# Altium schematic sheet Input channel.SchDoc
size A4; Organization: Altium Limited; Address1: L3, 12a Rodborough Rd; Address2: Frenchs Forest; Address3: NSW; Address4: Australia 2086; DocumentNumber: 4; SheetNumber: 4; SheetTotal: 8
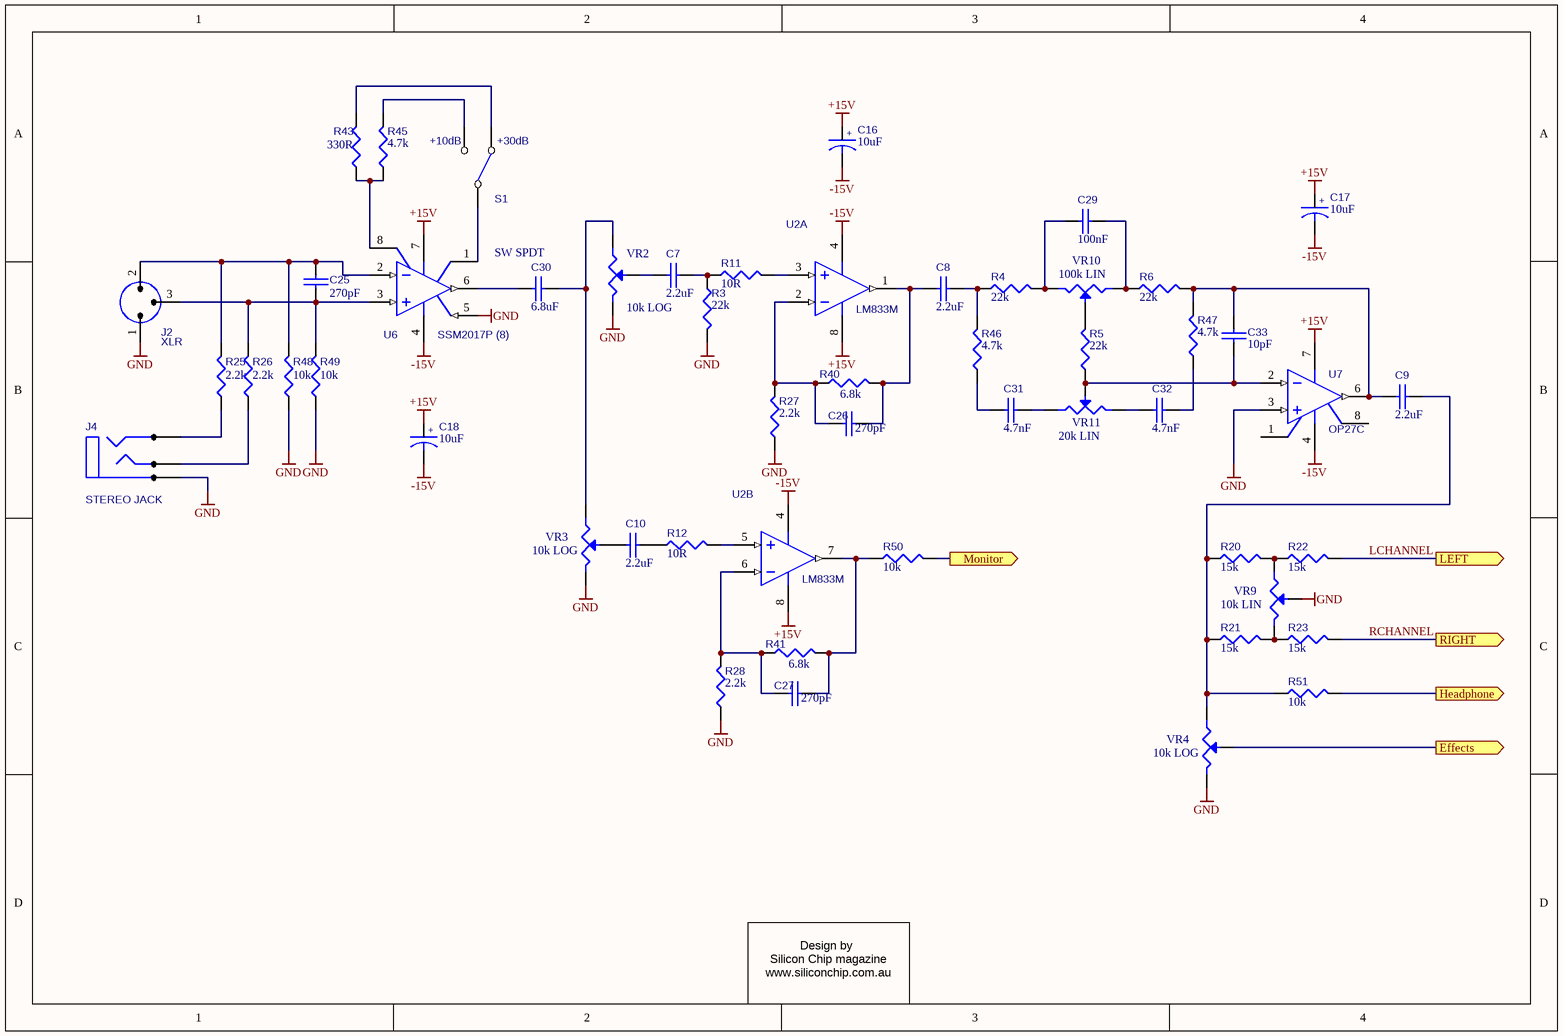
[diagram p0: Input channel.SchDoc]

## Parts
C7  2.2uF  [RB.2/.4-NP]
C8  2.2uF  [RB.2/.4-NP]
C9  2.2uF  [RB.2/.4-NP]
C10  2.2uF  [RB.2/.4-NP]
C16  10uF  [RB.2/.4]
C17  10uF  [RB.2/.4]
C18  10uF  [RB.2/.4]
C25  270pF  [RAD0.2]
C26  270pF  [RAD0.2]
C27  270pF  [RAD0.2]
C29  100nF  [RAD0.2]
C30  6.8uF  [RB.2/.4-NP]
C31  4.7nF  [RAD0.2]
C32  4.7nF  [RAD0.2]
C33  10pF  [RAD0.2]
J2  XLR  [XLR-FEMALE]
J4  STEREO JACK  [JACK-6.25MM]
R3  22k  [AXIAL0.4]
R4  22k  [AXIAL0.4]
R5  22k  [AXIAL0.4]
R6  22k  [AXIAL0.4]
R11  10R  [AXIAL0.4]
R12  10R  [AXIAL0.4]
R20  15k  [AXIAL0.4]
R21  15k  [AXIAL0.4]
R22  15k  [AXIAL0.4]
R23  15k  [AXIAL0.4]
R25  2.2k  [AXIAL0.4]
R26  2.2k  [AXIAL0.4]
R27  2.2k  [AXIAL0.4]
R28  2.2k  [AXIAL0.4]
R40  6.8k  [AXIAL0.4]
R41  6.8k  [AXIAL0.4]
R43  330R  [AXIAL0.4]
R45  4.7k  [AXIAL0.4]
R46  4.7k  [AXIAL0.4]
R47  4.7k  [AXIAL0.4]
R48  10k  [AXIAL0.4]
R49  10k  [AXIAL0.4]
R50  10k  [AXIAL0.4]
R51  10k  [AXIAL0.4]
S1  SW SPDT  [SW-SPDT]
U2  LM833M  [DIP8]  (parts A,B of 2)
U6  SSM2017P (8)  [DIP8]
U7  OP27C  [DIP8]
VR2  10k LOG  [POT - 24MM]
VR3  10k LOG  [POT - 24MM]
VR4  10k LOG  [POT - 24MM]
VR9  10k LIN  [POT - 24MM]
VR10  100k LIN  [POT - 24MM]
VR11  20k LIN  [POT - 24MM]

## Ports
Effects (out), Headphone (out), LEFT (out), Monitor (out), RIGHT (out)

## Nets
+15V: C16.1 C17.1 C18.1 U2.8(V+) U6.7(V+) U7.7(V+)
-15V: C16.2 C17.2 C18.2 U2.4(V-) U6.4(V-) U7.4(V-)
GND: J2.1 J4.3(C) R3.2 R27.1 R28.1 R48.1 R49.1 U6.5(REF) U7.3(+IN) VR2.3 VR3.3 VR4.3 VR9.2(W)
Effects: VR4.2(W) ; port Effects
Headphone: R51.2 ; port Headphone
LCHANNEL: R22.2 ; port LEFT
Monitor: R50.2 ; port Monitor
RCHANNEL: R23.2 ; port RIGHT
NetC7_1: C7.1 VR2.2(W)
NetC7_2: C7.2 R3.1 R11.1
NetC8_1: C8.1 C26.2 R40.2 U2.1(OUT1)
NetC8_2: C8.2 R4.1 R46.2
NetC9_1: C9.1 C33.2 R6.2 R47.2 U7.6(OUT)
NetC9_2: C9.2 R20.1 R21.1 R51.1 VR4.1
NetC10_1: C10.1 VR3.2(W)
NetC10_2: C10.2 R12.1
NetC25_1: C25.1 J2.2 R25.2 R48.2 U6.2(IN-)
NetC25_2: C25.2 J2.3 R26.2 R49.2 U6.3(IN+)
NetC26_1: C26.1 R27.2 R40.1 U2.2(IN1-)
NetC27_1: C27.1 R28.2 R41.1 U2.6(IN2-)
NetC27_2: C27.2 R41.2 R50.1 U2.7(OUT2)
NetC29_1: C29.1 R4.2 VR10.3
NetC29_2: C29.2 R6.1 VR10.1
NetC30_1: C30.1 U6.6(OUT)
NetC30_2: C30.2 VR2.1 VR3.1
NetC31_1: C31.1 R46.1
NetC31_2: C31.2 VR11.1
NetC32_1: C32.1 VR11.3
NetC32_2: C32.2 R47.1
NetC33_1: C33.1 R5.1 U7.2(-IN) VR11.2(W)
NetJ4_1: J4.1(A) R25.1
NetJ4_2: J4.2(B) R26.1
NetR5_2: R5.2 VR10.2(W)
NetR11_2: R11.2 U2.3(IN1+)
NetR12_2: R12.2 U2.5(IN2+)
NetR20_2: R20.2 R22.1 VR9.1
NetR21_2: R21.2 R23.1 VR9.3
NetR43_1: R43.1 R45.1 U6.8(RG2)
NetR43_2: R43.2 S1.2(NC)
NetR45_2: R45.2 S1.3(NO)
NetS1_1: S1.1(COMMON) U6.1(RG1)

Not connected (* = marked no-connect by the designer): U7 1(TRIM) 8(TRIM)

## Notes on the sheet
- (near S1) +10dB
- (near S1) +30dB
- Design by
  Silicon Chip magazine
  www.siliconchip.com.au
- Title
- Size:
- Date:
- A4
- Number:
- Time:
- Revision:
- Sheet
- of
- File:
- (in symbol CAPACITOR POL) +

## Library data of the parts
C7-C10 C25-C27 C29-C33 = CAP: Capacitor
  C26 C27: Value: 270pF
C16-C18 = CAPACITOR POL: Bi-Polar Capacitor; Value: 10uF
J2 = XLR: XLR connector, PCB mounted
J4 = PHONEJACK STEREO
R3-R6 R11 R12 R20-R23 R25-R28 R40 R41 R43 R45-R51 = RES1: Resistor
  R3-R6: Value: 22k
  R11 R12: Value: 10R
  R20-R23: Value: 15k
  R25-R28: Value: 2.2k
  R40 R41: Value: 6.8k
  R43: Value: 330R
  R45-R47: Value: 4.7k
  R48-R51: Value: 10k
U2 = LM833M: Fast Settling Dual Operational Amplifier
U6 = SSM2017P (8): Self-Contained Audio Preamplifier
U7 = OP27C: Low Noise, High Speed Precision Operational Amplifier
VR2-VR4 VR9-VR11 = POT1: Potentiometer